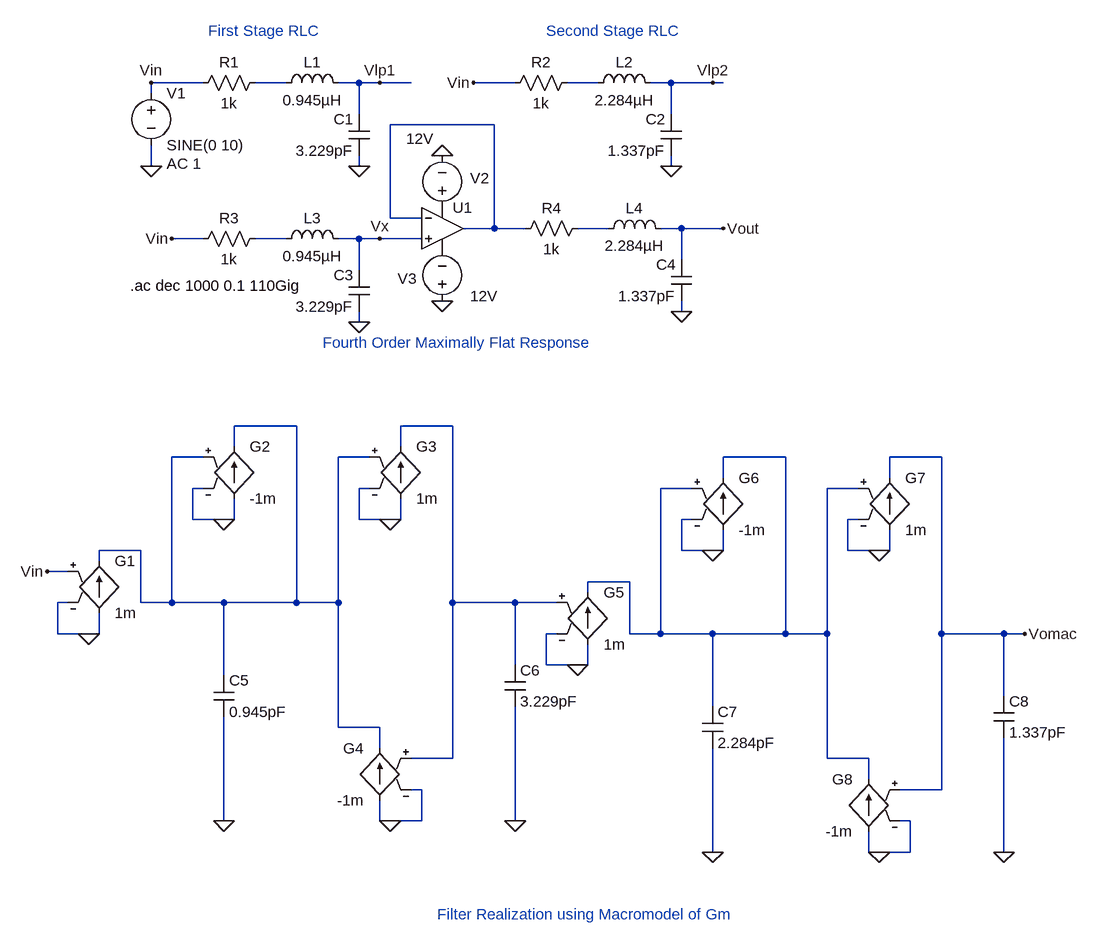
[diagram p0: schematic Project.asc]
Project.asc, the LTspice schematic file:
Version 4
SHEET 1 1292 1408
WIRE -64 112 -144 112
WIRE 64 112 16 112
WIRE 176 112 144 112
WIRE 208 112 176 112
WIRE 256 112 208 112
WIRE 416 112 352 112
WIRE 544 112 496 112
WIRE 656 112 624 112
WIRE 720 112 656 112
WIRE 736 112 720 112
WIRE -144 128 -144 112
WIRE 176 160 176 112
WIRE 656 160 656 112
WIRE 384 176 224 176
WIRE -144 240 -144 208
WIRE 176 240 176 224
WIRE 656 240 656 224
WIRE 224 320 224 176
WIRE 272 320 224 320
WIRE 384 336 384 176
WIRE 384 336 336 336
WIRE 432 336 384 336
WIRE 560 336 512 336
WIRE 672 336 640 336
WIRE 736 336 672 336
WIRE -64 352 -112 352
WIRE 64 352 16 352
WIRE 176 352 144 352
WIRE 208 352 176 352
WIRE 272 352 208 352
WIRE 672 384 672 336
WIRE 176 400 176 352
WIRE 672 464 672 448
WIRE 176 480 176 464
WIRE 80 640 -16 640
WIRE 320 640 240 640
WIRE -16 672 -16 640
WIRE 240 672 240 640
WIRE -64 688 -112 688
WIRE 192 688 144 688
WIRE 832 688 736 688
WIRE 1072 688 992 688
WIRE 736 720 736 688
WIRE 992 720 992 688
WIRE -64 736 -80 736
WIRE 192 736 176 736
WIRE 688 736 640 736
WIRE 944 736 896 736
WIRE -80 784 -80 736
WIRE -32 784 -80 784
WIRE -16 784 -16 752
WIRE -16 784 -32 784
WIRE 176 784 176 736
WIRE 224 784 176 784
WIRE 240 784 240 752
WIRE 240 784 224 784
WIRE 688 784 672 784
WIRE 944 784 928 784
WIRE -160 832 -224 832
WIRE 672 832 672 784
WIRE 720 832 672 832
WIRE 736 832 736 800
WIRE 736 832 720 832
WIRE 928 832 928 784
WIRE 976 832 928 832
WIRE 992 832 992 800
WIRE 992 832 976 832
WIRE -224 848 -224 832
WIRE -272 864 -304 864
WIRE 592 880 528 880
WIRE 528 896 528 880
WIRE -272 912 -288 912
WIRE -160 912 -160 832
WIRE -112 912 -112 688
WIRE -112 912 -160 912
WIRE -32 912 -112 912
WIRE 80 912 80 640
WIRE 80 912 -32 912
WIRE 144 912 144 688
WIRE 144 912 80 912
WIRE 320 912 320 640
WIRE 416 912 320 912
WIRE 480 912 416 912
WIRE -288 960 -288 912
WIRE -240 960 -288 960
WIRE -224 960 -224 928
WIRE -224 960 -240 960
WIRE 480 960 464 960
WIRE 592 960 592 880
WIRE 640 960 640 736
WIRE 640 960 592 960
WIRE 720 960 640 960
WIRE 832 960 832 688
WIRE 832 960 720 960
WIRE 896 960 896 736
WIRE 896 960 832 960
WIRE 1072 960 1072 688
WIRE 1168 960 1072 960
WIRE 1200 960 1168 960
WIRE 416 1008 416 912
WIRE 464 1008 464 960
WIRE 512 1008 464 1008
WIRE 528 1008 528 976
WIRE 528 1008 512 1008
WIRE -32 1024 -32 912
WIRE 1168 1056 1168 960
WIRE 720 1072 720 960
WIRE 144 1104 144 912
WIRE 208 1104 144 1104
WIRE 208 1136 208 1104
WIRE 320 1152 320 912
WIRE 320 1152 256 1152
WIRE 896 1152 896 960
WIRE 960 1152 896 1152
WIRE 960 1184 960 1152
WIRE 272 1200 256 1200
WIRE 1072 1200 1072 960
WIRE 1072 1200 1008 1200
WIRE -32 1248 -32 1088
WIRE 208 1248 208 1216
WIRE 224 1248 208 1248
WIRE 272 1248 272 1200
WIRE 272 1248 224 1248
WIRE 416 1248 416 1072
WIRE 1024 1248 1008 1248
WIRE 720 1296 720 1136
WIRE 960 1296 960 1264
WIRE 976 1296 960 1296
WIRE 1024 1296 1024 1248
WIRE 1024 1296 976 1296
WIRE 1168 1296 1168 1120
FLAG -144 240 0
FLAG 176 240 0
FLAG 656 240 0
FLAG -144 112 Vin
FLAG 208 112 Vlp1
FLAG 720 112 Vlp2
FLAG 352 112 Vin
FLAG 176 480 0
FLAG 672 464 0
FLAG 208 352 Vx
FLAG 304 224 0
FLAG 304 448 0
FLAG -112 352 Vin
FLAG 736 336 Vout
FLAG -240 960 0
FLAG -32 784 0
FLAG 224 784 0
FLAG 224 1248 0
FLAG -32 1248 0
FLAG 416 1248 0
FLAG 512 1008 0
FLAG 720 832 0
FLAG 976 832 0
FLAG 976 1296 0
FLAG 720 1296 0
FLAG 1168 1296 0
FLAG -304 864 Vin
FLAG 1200 960 Vomac
SYMBOL res 32 96 R90
WINDOW 0 0 56 VBottom 2
WINDOW 3 32 56 VTop 2
SYMATTR InstName R1
SYMATTR Value 1k
SYMBOL cap 192 224 R180
WINDOW 0 24 56 Left 2
WINDOW 3 24 8 Left 2
SYMATTR InstName C1
SYMATTR Value 3.229pF
SYMBOL ind 48 128 R270
WINDOW 0 32 56 VTop 2
WINDOW 3 5 56 VBottom 2
SYMATTR InstName L1
SYMATTR Value 0.945µH
SYMATTR SpiceLine Rser=0
SYMBOL res 512 96 R90
WINDOW 0 0 56 VBottom 2
WINDOW 3 32 56 VTop 2
SYMATTR InstName R2
SYMATTR Value 1k
SYMBOL cap 672 224 R180
WINDOW 0 24 56 Left 2
WINDOW 3 24 8 Left 2
SYMATTR InstName C2
SYMATTR Value 1.337pF
SYMBOL ind 528 128 R270
WINDOW 0 32 56 VTop 2
WINDOW 3 5 56 VBottom 2
SYMATTR InstName L2
SYMATTR Value 2.284µH
SYMATTR SpiceLine Rser=0
SYMBOL voltage -144 112 R0
WINDOW 123 24 124 Left 2
WINDOW 39 0 0 Left 0
SYMATTR Value2 AC 1
SYMATTR InstName V1
SYMATTR Value SINE(0 10)
SYMBOL res 32 336 R90
WINDOW 0 0 56 VBottom 2
WINDOW 3 32 56 VTop 2
SYMATTR InstName R3
SYMATTR Value 1k
SYMBOL cap 192 464 R180
WINDOW 0 24 56 Left 2
WINDOW 3 24 8 Left 2
SYMATTR InstName C3
SYMATTR Value 3.229pF
SYMBOL ind 48 368 R270
WINDOW 0 32 56 VTop 2
WINDOW 3 5 56 VBottom 2
SYMATTR InstName L3
SYMATTR Value 0.945µH
SYMATTR SpiceLine Rser=0
SYMBOL res 528 320 R90
WINDOW 0 0 56 VBottom 2
WINDOW 3 32 56 VTop 2
SYMATTR InstName R4
SYMATTR Value 1k
SYMBOL cap 688 448 R180
WINDOW 0 24 56 Left 2
WINDOW 3 24 8 Left 2
SYMATTR InstName C4
SYMATTR Value 1.337pF
SYMBOL ind 544 352 R270
WINDOW 0 32 56 VTop 2
WINDOW 3 5 56 VBottom 2
SYMATTR InstName L4
SYMATTR Value 2.284µH
SYMATTR SpiceLine Rser=0
SYMBOL OpAmps\\UniversalOpamp2 304 336 R0
SYMATTR InstName U1
SYMATTR Value2 Avol=1Meg GBW=10000Gig Slew=10000Gig
SYMATTR SpiceLine2 En=0 Enk=0 In=0 Ink=0 Rin=500Meg Ro=1 Ccm=0.00001pF Cdiff=0.000012p
SYMBOL voltage 304 320 R180
WINDOW 0 -72 61 Left 2
WINDOW 3 13 122 Left 2
WINDOW 123 0 0 Left 0
WINDOW 39 0 0 Left 0
SYMATTR InstName V2
SYMATTR Value 12V
SYMBOL voltage 304 464 R180
WINDOW 0 39 51 Left 2
WINDOW 3 -86 24 Left 2
SYMATTR InstName V3
SYMATTR Value 12V
SYMBOL g -224 832 R0
SYMATTR InstName G1
SYMATTR Value 1m
SYMBOL g -16 656 R0
SYMATTR InstName G2
SYMATTR Value -1m
SYMBOL g 240 656 R0
SYMATTR InstName G3
SYMATTR Value 1m
SYMBOL g 208 1120 M0
SYMATTR InstName G4
SYMATTR Value -1m
SYMBOL cap -48 1024 R0
SYMATTR InstName C5
SYMATTR Value 0.945pF
SYMBOL cap 400 1008 R0
SYMATTR InstName C6
SYMATTR Value 3.229pF
SYMBOL g 528 880 R0
SYMATTR InstName G5
SYMATTR Value 1m
SYMBOL g 736 704 R0
SYMATTR InstName G6
SYMATTR Value -1m
SYMBOL g 992 704 R0
SYMATTR InstName G7
SYMATTR Value 1m
SYMBOL g 960 1168 M0
SYMATTR InstName G8
SYMATTR Value -1m
SYMBOL cap 704 1072 R0
SYMATTR InstName C7
SYMATTR Value 2.284pF
SYMBOL cap 1152 1056 R0
SYMATTR InstName C8
SYMATTR Value 1.337pF
TEXT -56 32 Left 2 ;First Stage RLC
TEXT 464 32 Left 2 ;Second Stage RLC
TEXT -176 424 Left 2 !.ac dec 1000 0.1 110Gig
TEXT 120 512 Left 2 ;Fourth Order Maximally Flat Response
TEXT 296 1392 Left 2 ;Filter Realization using Macromodel of Gm

The netlist it stands for:
* Project.asc
R1 N001 Vin 1k
C1 0 Vlp1 3.229pF
L1 N001 Vlp1 0.945µH Rser=0
R2 N002 Vin 1k
C2 0 Vlp2 1.337pF
L2 N002 Vlp2 2.284µH Rser=0
V1 Vin 0 SINE(0 10) AC 1
R3 N005 Vin 1k
C3 0 Vx 3.229pF
L3 N005 Vx 0.945µH Rser=0
R4 N004 N003 1k
C4 0 Vout 1.337pF
L4 N004 Vout 2.284µH Rser=0
XU1 Vx N003 P001 P002 N003 level.2 Avol=1Meg GBW=10000Gig Slew=10000Gig ilimit=25m rail=0 Vos=0 phimargin=45 En=0 Enk=0 In=0 Ink=0 Rin=500Meg Ro=1 Ccm=0.00001pF Cdiff=0.000012p  ; pins IN+ IN- V+ V- OUT
V2 P001 0 12V
V3 0 P002 12V
G1 0 N006 Vin 0 1m
G2 0 N006 N006 0 -1m
G3 0 N007 N006 0 1m
G4 0 N006 N007 0 -1m
C5 N006 0 0.945pF
C6 N007 0 3.229pF
G5 0 N008 N007 0 1m
G6 0 N008 N008 0 -1m
G7 0 Vomac N008 0 1m
G8 0 N008 Vomac 0 -1m
C7 N008 0 2.284pF
C8 Vomac 0 1.337pF
* First Stage RLC
* Second Stage RLC
.ac dec 1000 0.1 110Gig
* Fourth Order Maximally Flat Response
* Filter Realization using Macromodel of Gm
.lib UniversalOpamps2.sub
.backanno
.end